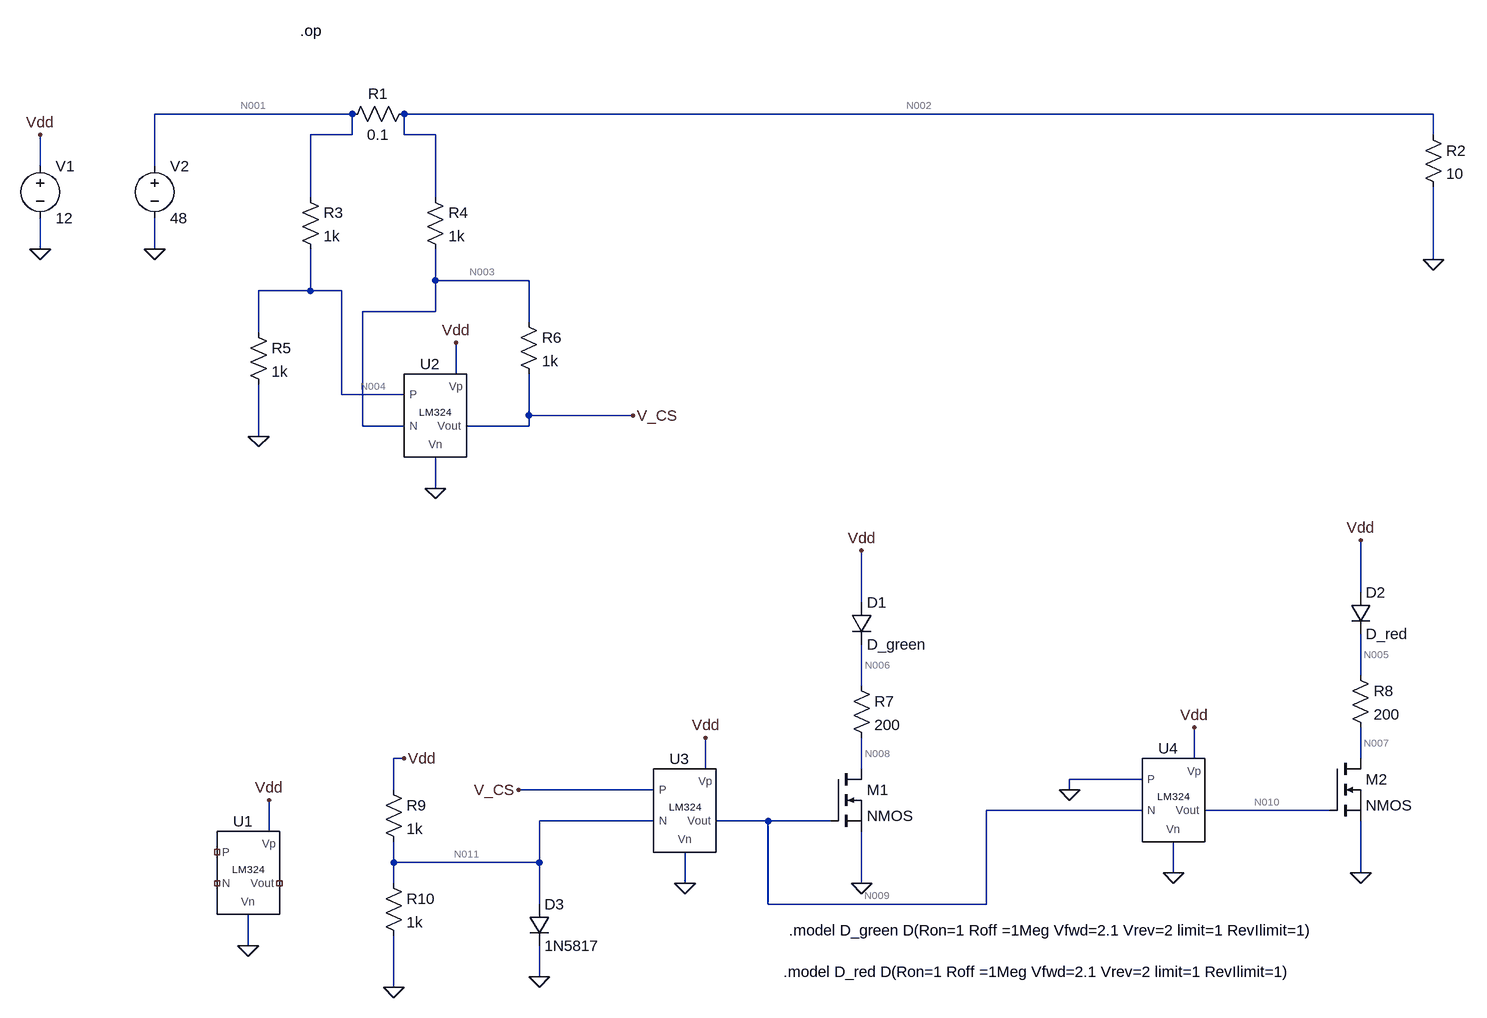
[diagram p0: schematic Draft2.asc]
Draft2.asc, the LTspice schematic file:
Version 4.1
SHEET 1 2072 680
WIRE 352 -704 48 -704
WIRE 2016 -704 432 -704
WIRE 352 -672 352 -704
WIRE 352 -672 288 -672
WIRE 432 -672 432 -704
WIRE 480 -672 432 -672
WIRE 2016 -672 2016 -704
WIRE -128 -624 -128 -672
WIRE 48 -624 48 -704
WIRE 288 -576 288 -672
WIRE 480 -576 480 -672
WIRE -128 -496 -128 -544
WIRE 48 -496 48 -544
WIRE 2016 -480 2016 -592
WIRE 480 -448 480 -496
WIRE 624 -448 480 -448
WIRE 288 -432 288 -496
WIRE 288 -432 208 -432
WIRE 336 -432 288 -432
WIRE 480 -400 480 -448
WIRE 480 -400 368 -400
WIRE 624 -384 624 -448
WIRE 208 -368 208 -432
WIRE 512 -304 512 -352
WIRE 336 -272 336 -432
WIRE 432 -272 336 -272
WIRE 624 -240 624 -304
WIRE 784 -240 624 -240
WIRE 368 -224 368 -400
WIRE 432 -224 368 -224
WIRE 624 -224 624 -240
WIRE 624 -224 528 -224
WIRE 208 -208 208 -288
WIRE 480 -128 480 -176
WIRE 1904 32 1904 -48
WIRE 1136 48 1136 -32
WIRE 1904 160 1904 96
WIRE 1136 176 1136 112
WIRE 432 288 416 288
WIRE 1648 288 1648 240
WIRE 1904 288 1904 240
WIRE 896 304 896 256
WIRE 1136 304 1136 256
WIRE 1568 320 1456 320
WIRE 416 336 416 288
WIRE 816 336 608 336
WIRE 1456 336 1456 320
WIRE 1568 368 1328 368
WIRE 1856 368 1664 368
WIRE 816 384 640 384
WIRE 992 384 912 384
WIRE 1088 384 992 384
WIRE 224 400 224 352
WIRE 416 448 416 416
WIRE 640 448 640 384
WIRE 640 448 416 448
WIRE 1616 464 1616 416
WIRE 1904 464 1904 384
WIRE 416 480 416 448
WIRE 864 480 864 432
WIRE 1136 480 1136 400
WIRE 640 512 640 448
WIRE 992 512 992 384
WIRE 1328 512 1328 368
WIRE 1328 512 992 512
WIRE 192 576 192 528
WIRE 640 624 640 576
WIRE 416 640 416 560
FLAG -128 -496 0
FLAG -128 -672 Vdd
FLAG 224 352 Vdd
FLAG 192 576 0
FLAG 512 -352 Vdd
FLAG 480 -128 0
FLAG 896 256 Vdd
FLAG 864 480 0
FLAG 1648 240 Vdd
FLAG 1616 464 0
FLAG 48 -496 0
FLAG 2016 -480 0
FLAG 208 -208 0
FLAG 784 -240 V_CS
FLAG 1136 480 0
FLAG 1904 464 0
FLAG 1136 -32 Vdd
FLAG 1904 -48 Vdd
FLAG 608 336 V_CS
FLAG 640 624 0
FLAG 416 640 0
FLAG 432 288 Vdd
FLAG 1456 336 0
DATAFLAG 624 -224 ""
DATAFLAG 624 -224 ""
DATAFLAG 464 -400 ""
DATAFLAG 336 -336 ""
DATAFLAG 1760 368 ""
DATAFLAG 1360 368 ""
DATAFLAG 608 448 ""
DATAFLAG 688 336 ""
DATAFLAG 1024 384 ""
DATAFLAG 1504 320 ""
SYMBOL voltage -128 -640 R0
WINDOW 123 0 0 Left 0
WINDOW 39 0 0 Left 0
SYMATTR InstName V1
SYMATTR Value 12
SYMBOL LM324 192 464 R0
SYMATTR InstName U1
SYMBOL LM324 480 -240 R0
SYMATTR InstName U2
SYMBOL LM324 864 368 R0
SYMATTR InstName U3
SYMBOL LM324 1616 352 R0
SYMATTR InstName U4
SYMBOL voltage 48 -640 R0
WINDOW 123 0 0 Left 0
WINDOW 39 0 0 Left 0
SYMATTR InstName V2
SYMATTR Value 48
SYMBOL res 448 -720 R90
WINDOW 0 0 56 VBottom 2
WINDOW 3 32 56 VTop 2
SYMATTR InstName R1
SYMATTR Value 0.1
SYMBOL res 2000 -688 R0
SYMATTR InstName R2
SYMATTR Value 10
SYMBOL res 272 -592 R0
SYMATTR InstName R3
SYMATTR Value 1k
SYMBOL res 464 -592 R0
SYMATTR InstName R4
SYMATTR Value 1k
SYMBOL res 192 -384 R0
SYMATTR InstName R5
SYMATTR Value 1k
SYMBOL res 608 -400 R0
SYMATTR InstName R6
SYMATTR Value 1k
SYMBOL nmos 1088 304 R0
SYMATTR InstName M1
SYMBOL nmos 1856 288 R0
SYMATTR InstName M2
SYMBOL res 1120 160 R0
SYMATTR InstName R7
SYMATTR Value 200
SYMBOL res 1888 144 R0
SYMATTR InstName R8
SYMATTR Value 200
SYMBOL diode 1120 48 R0
SYMATTR InstName D1
SYMATTR Value D_green
SYMBOL diode 1888 32 R0
SYMATTR InstName D2
SYMATTR Value D_red
SYMBOL diode 624 512 R0
SYMATTR InstName D3
SYMATTR Value 1N5817
SYMATTR Description Diode
SYMATTR Type diode
SYMBOL res 400 320 R0
SYMATTR InstName R9
SYMATTR Value 1k
SYMBOL res 400 464 R0
SYMATTR InstName R10
SYMATTR Value 1k
TEXT 272 -832 Left 2 !.op
TEXT 1024 552 Left 2 !.model D_green D(Ron=1 Roff =1Meg Vfwd=2.1 Vrev=2 limit=1 RevIlimit=1)
TEXT 1016 616 Left 2 !.model D_red D(Ron=1 Roff =1Meg Vfwd=2.1 Vrev=2 limit=1 RevIlimit=1)

The netlist it stands for:
* Draft2.asc
V1 Vdd 0 12
X§U1 NC_01 NC_02 Vdd 0 NC_03 LM324  ; pins P N Vp Vn Vout
X§U2 N004 N003 Vdd 0 V_CS LM324  ; pins P N Vp Vn Vout
X§U3 V_CS N011 Vdd 0 N009 LM324  ; pins P N Vp Vn Vout
X§U4 0 N009 Vdd 0 N010 LM324  ; pins P N Vp Vn Vout
V2 N001 0 48
R1 N002 N001 0.1
R2 N002 0 10
R3 N001 N004 1k
R4 N002 N003 1k
R5 N004 0 1k
R6 N003 V_CS 1k
M1 N008 N009 0 0 NMOS
M2 N007 N010 0 0 NMOS
R7 N006 N008 200
R8 N005 N007 200
D1 Vdd N006 D_green
D2 Vdd N005 D_red
D3 N011 0 1N5817
R9 Vdd N011 1k
R10 N011 0 1k
.model D D
.lib standard.dio
.model NMOS NMOS
.model PMOS PMOS
.lib standard.mos
.op
.model D_green D(Ron=1 Roff =1Meg Vfwd=2.1 Vrev=2 limit=1 RevIlimit=1)
.model D_red D(Ron=1 Roff =1Meg Vfwd=2.1 Vrev=2 limit=1 RevIlimit=1)
.lib C:\Users\spenc\Documents\automatic-octo-happiness\LM324.ti.lib
.backanno
.end

* Results of the author's LTspice run, read from the files saved beside the schematic
* Operating Point:
*   V(n004) = 24 V
*   V(v_cs) = 475.5 mV
*   V(n010) = 4.008 mV
*   V(n002) = 47.52 V
*   V(n008) = 9.68 V
*   V(n006) = 9.899 V
*   V(vdd) = 12 V
*   V(n003) = 24 V
*   V(n011) = 210.2 mV
*   V(n009) = 10.5 V
*   V(n001) = 48 V
*   V(n007) = 12 V
*   V(n005) = 12 V
*   I(V1) = -14.5 mA
*   I(R2) = 4.752 A
*   I(R4) = 23.52 mA
*   I(R6) = 23.52 mA
*   Id(M1) = 1.095 mA
*   Ig(M1) = 0 A
*   Is(M1) = -1.095 mA
*   Ib(M1) = -9.69 pA
*   I(R7) = 1.095 mA
*   I(R9) = 11.79 mA
*   I(R10) = 210.2 µA
*   I(R1) = -4.776 A
*   I(D2) = 184.6 pA
*   I(R3) = 24 mA
*   I(R5) = 24 mA
*   I(R8) = 184.6 pA
*   I(D3) = 11.58 mA
*   I(V2) = -4.8 A
*   Id(M2) = 184.6 pA
*   Ig(M2) = 0 A
*   Is(M2) = -172.6 pA
*   Ib(M2) = -12.01 pA
*   I(D1) = 1.095 mA